# EAGLE design hbridge (EAGLE 5.06)
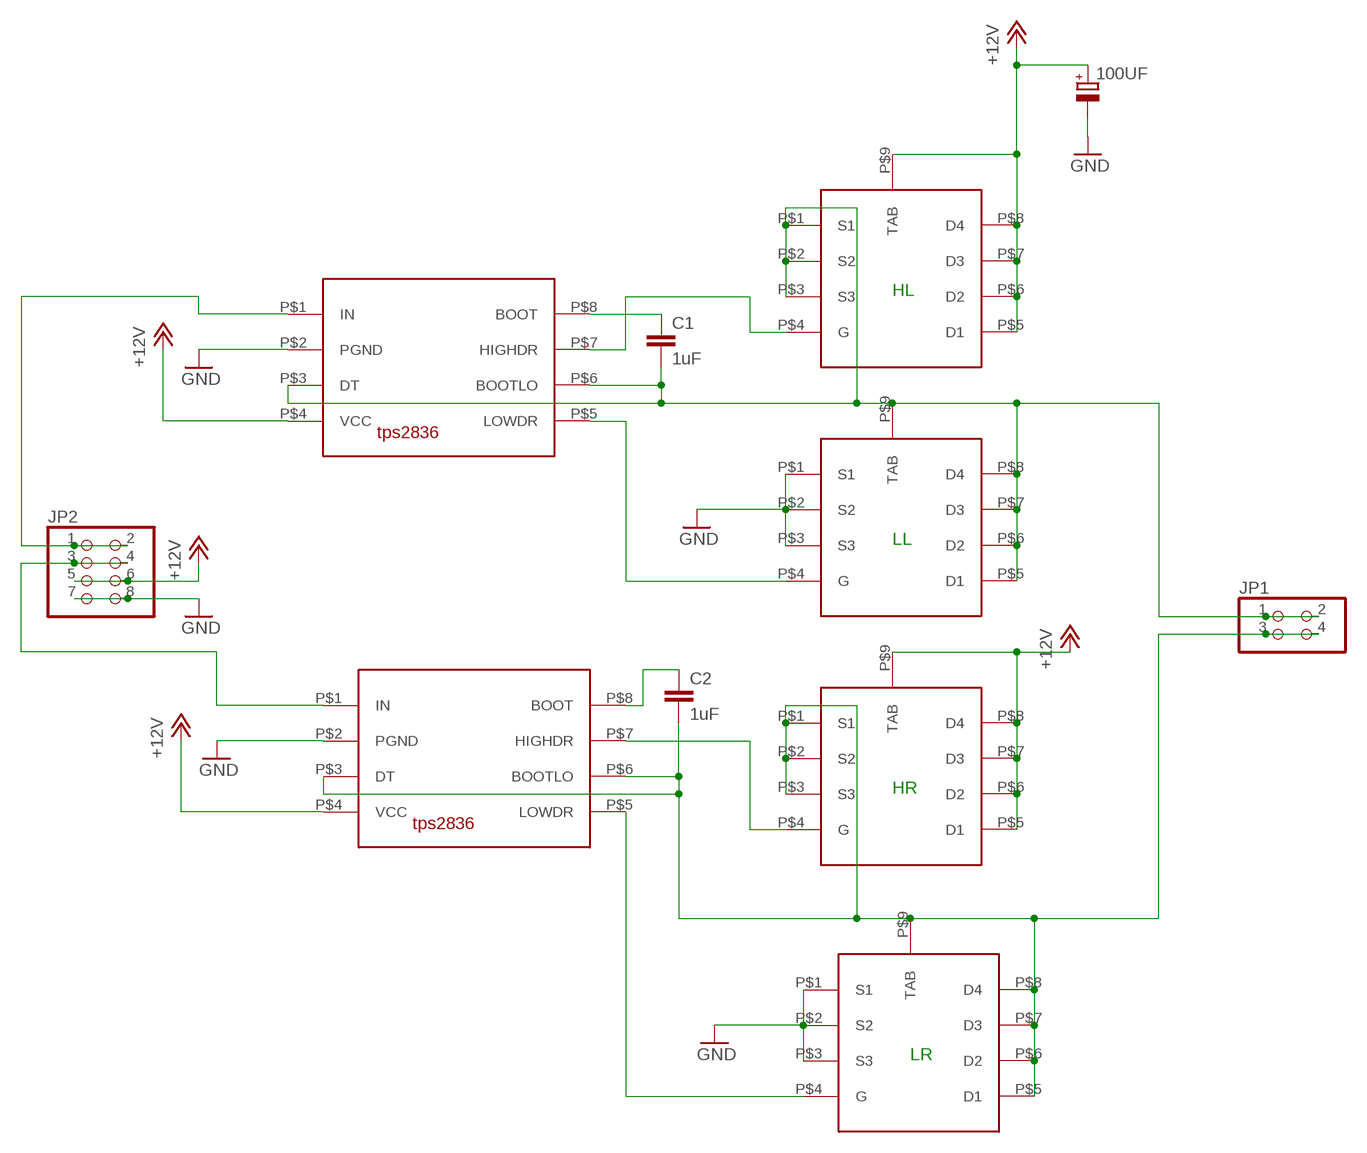
[diagram p0: schematic, sheet 1]

## Parts
100UF  CPOL-EU175TMP-0808  [175TMP-0808]
C1  1uF  C-EUC0805K  [C0805K]
C2  1uF  C-EUC0805K  [C0805K]
JP1  PINHD-2X2  [2X02]
JP2  PINHD-2X4  [2X04]
U$1  TPS2836  [D-SOIC-8]
U$2  TPS2836  [D-SOIC-8]
U$3  CSD16404  [QFN-8]
U$4  CSD16404  [QFN-8]
U$5  CSD16404  [QFN-8]
U$6  CSD16404  [QFN-8]

## Nets
+12V: 100UF.+ JP2.5 JP2.6 U$1.P$4(VCC) U$2.P$4(VCC) U$3.P$5(D1) U$3.P$6(D2) U$3.P$7(D3) U$3.P$8(D4) U$3.P$9(TAB) U$5.P$5(D1) U$5.P$6(D2) U$5.P$7(D3) U$5.P$8(D4) U$5.P$9(TAB)
GND: 100UF.- JP2.7 JP2.8 U$1.P$2(PGND) U$2.P$2(PGND) U$4.P$1(S1) U$4.P$2(S2) U$4.P$3(S3) U$6.P$1(S1) U$6.P$2(S2) U$6.P$3(S3)
N$1: C1.2 JP1.1 JP1.2 U$1.P$3(DT) U$1.P$6(BOOTLO) U$3.P$1(S1) U$3.P$2(S2) U$3.P$3(S3) U$4.P$5(D1) U$4.P$6(D2) U$4.P$7(D3) U$4.P$8(D4) U$4.P$9(TAB)
N$2: C1.1 U$1.P$8(BOOT)
N$4: U$1.P$7(HIGHDR) U$3.P$4(G)
N$5: U$1.P$5(LOWDR) U$4.P$4(G)
N$7: U$2.P$7(HIGHDR) U$5.P$4(G)
N$12: U$2.P$5(LOWDR) U$6.P$4(G)
N$14: C2.1 U$2.P$8(BOOT)
N$15: C2.2 JP1.3 JP1.4 U$2.P$3(DT) U$2.P$6(BOOTLO) U$5.P$1(S1) U$5.P$2(S2) U$5.P$3(S3) U$6.P$5(D1) U$6.P$6(D2) U$6.P$7(D3) U$6.P$8(D4) U$6.P$9(TAB)
N$17: JP2.1 JP2.2 U$1.P$1(IN)
N$18: JP2.3 JP2.4 U$2.P$1(IN)

## Notes on the sheet
- HL
- LL
- HR
- LR

## Library data of the parts
100UF = rcl:CPOL-EU: POLARIZED CAPACITOR, European symbol
C1 C2 = rcl:C-EU: CAPACITOR, European symbol
JP1 = pinhead:PINHD-2X2: PIN HEADER
JP2 = pinhead:PINHD-2X4: PIN HEADER
U$1 U$2 = slom:TPS2836
U$3-U$6 = slom:CSD16404

## Board
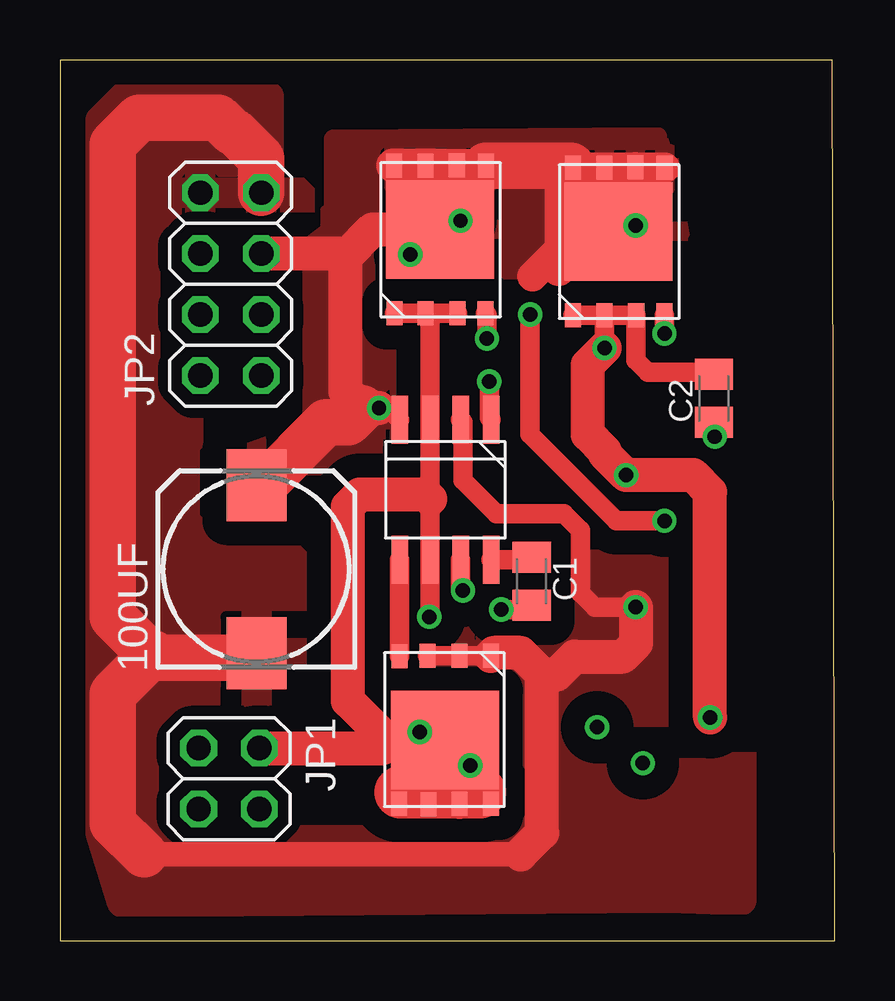
[diagram p1: board, top side]
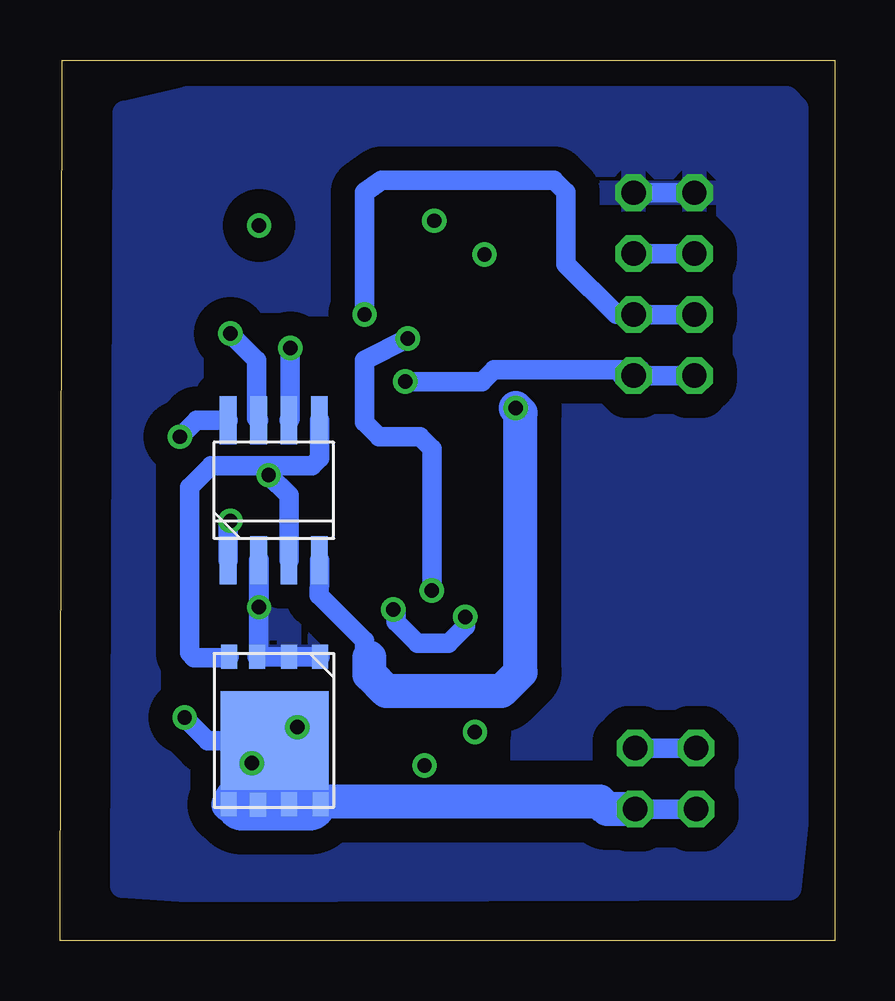
[diagram p2: board, bottom side, seen from below]

Size 32.3 x 36.7 mm. Coordinates in mm from the lower left corner, seen from the top.
Outline: 0,0 32.3,0 32.2,36.7 0,36.7 0,0
Copper layers (1*16): Top 0.035mm / dielectric 1.5mm / Bottom 0.035mm
Design rules "default": minimum track width 10mil, minimum drill 24mil, track to track 8mil, track to pad 8mil, pad to pad 8mil, via to via 8mil, smd to smd 8mil, copper to edge 40mil, drill to drill 8mil, minimum pad ring 10mil, minimum via ring 8mil, stop-mask expansion 4mil, vias tented up to drill 0mil, thermal gap 10mil

### Footprints (pad centres in the part's own frame; a part is rotated, then mirrored left to right if it is on the bottom)
175TMP-0808 = smd 3 x 2.5: + 3.5,0; - -3.5,0
C0805K = smd 1.3 x 1.6: 1 -1,0; 2 1,0
2X02 = drill 1.016 octagon: 1 -1.27,-1.27; 2 -1.27,1.27; 3 1.27,-1.27; 4 1.27,1.27
2X04 = drill 1.016 octagon: 1 -3.81,-1.27; 2 -3.81,1.27; 3 -1.27,-1.27; 4 -1.27,1.27; 5 1.27,-1.27; 6 1.27,1.27; 7 3.81,-1.27; 8 3.81,1.27
D-SOIC-8 = smd 0.7 x 2: P$1 -1.905,-2.921; P$2 -0.635,-2.921; P$3 0.635,-2.921; P$4 1.905,-2.921; P$5 1.905,2.921; P$6 0.635,2.921; P$7 -0.635,2.921; P$8 -1.905,2.921
QFN-8 = smd 1 x 0.67: P$1 0.53,4.23; P$2 0.53,2.93; P$3 0.53,1.6; P$4 0.54,0.43; P$5 6.69,0.41; P$6 6.7,1.63; P$7 6.69,2.93; P$8 6.69,4.24 | smd 4.1 x 4.5: P$9 4.03,2.33

### Placement (x,y rotation side)
100UF  8.19,15.49 90 top
C1  19.66,14.98 270 top
C2  27.26,22.6 90 top
JP1  7.05,6.76 270 top
JP2  7.12,27.36 90 top
U$1  16.07,18.79 180 top
U$2  23.39,18.77 0 bottom
U$3  18.17,25.61 90 top
U$4  13.73,12.4 270 top
U$5  25.62,25.53 90 top
U$6  25.68,12.37 270 bottom

### Tracks (layer width: path | path; a pad name or v marks a point on that pad's centre or on a via)
+12V  (via drill 0.6 pad 1.02)
  Top 0.813: U$3.P$7 U$3.P$8 | v13.3,22.2 13.68,22.2 U$1.P$4 | U$5.P$9 23.29,31.62 U$5.P$7 | 24.22,32.22 U$5.P$6
  Top 1.27: U$3.P$7 15.24,30.66 15.7,30.2 | 15.7,30.2 15.7,32 16,32.3 U$3.P$6 U$3.P$5 | U$3.P$9 15.84,30.06 15.7,30.2 | 20.9,32.4 21.2,32.4 U$5.P$8 U$5.P$7 U$5.P$6 | U$5.P$5 24.22,32.22 19.7,27.7
  Top 1.422: 13.9,32.3 U$3.P$7 16,32.3 U$3.P$5 | 20.9,32.4 20.9,28.1 20.8,28 | 13.04,29.64 U$3.P$9 | 13.04,29.64 11.9,28.5 11.9,22.9 12.6,22.2 v13.3,22.2 | JP2.5 12.03,28.63 13.04,29.64
  Top 1.93: 100UF.+ 8.49,18.99 11.1,21.6 12,21.6 12.6,22.2 | U$3.P$5 21.3,32.3 U$5.P$8
  Bottom 0.813: U$2.P$4 21.48,15.09 21.5,14.4 19.6,12.5 19.6,12 19.4,11.8 | JP2.5 JP2.6
  Bottom 1.422: 19.4,11.8 19.4,11.1 18.7,10.4 13.9,10.4 13.1,11.2 13.1,22 v13.3,22.2
  pour Top (isolate 1): 13.3,32.8 25,32.9 25.4,32.8 25.4,27.8 14,27.6 13.3,28.4 13.4,29.1
  pour Top (isolate 1): 10.5,21.3 10.5,29 11.3,29.6 11.2,30.3 11.4,30.3 11.4,33.4 24.9,33.5 25.3,32.4 26.3,26.9 25.9,26.4 15.1,26.1 15,21.3 13.1,21.3 13,19.5 7.2,20.1
GND  (via drill 0.6 pad 1.02)
  Top 0.813: U$4.P$3 U$4.P$2 U$4.P$1 | v24,13.9 22.3,13.9 21.7,14.5 21.7,17.1 21,17.8 18.2,17.8 16.8,19.2 16.8,21.62 U$1.P$2
  Top 1.016: 3.5,3.6 19.2,3.6
  Top 1.422: 3.89,11.99 100UF.- | 19.2,3.6 20.1,4.5 20.1,11.1 | 20.1,11.1 19.2,12 18.09,12 U$4.P$1 | 20.1,11.1 20.71,11.1 U$6.P$1 23.46,11.84 24.02,12.4 24.02,13.88 v24,13.9
  Top 1.93: JP2.7 8.39,32.61 7.3,33.7 7.2,33.7 6.6,34.3 3.3,34.3 2.2,33.2 2.2,13.5 3.9,11.8 8,11.8 100UF.- | 3.89,11.99 2.2,10.3 2.2,4.9 3.5,3.6
  Bottom 0.813: U$6.P$1 U$6.P$2 U$6.P$3 24.02,11.89 U$2.P$2 24,15.87 v24,13.9 | JP2.7 JP2.8
  pour Top (isolate 1): 8.7,31.3 8.7,35.2 8.5,35.4 2.9,35.4 1.7,34.2 1.7,4.5 2.6,1.6 25.3,1.8 28.4,1.7 28.4,15.6 22.8,15.6 21.3,17.1 14.7,17.1 13.4,15.8 13.4,11.2 14.8,9.8 17.2,9.8 17.9,9.1 17.9,4.3 17.8,4.2 9.3,4.2 9.1,4 4.6,4 3.6,5 3.6,9.1 4.6,10.1 9.7,10.1 10,10.4 10,15.6 9.5,16.1 6.6,16.1 5.2,17.5 5.2,20.7 6.1,21.6 9.5,21.6 10.3,22.4 10.3,30.8 9.8,31.3
  pour Bottom (isolate 1): 2,35.1 27,35.1 29.6,34.5 29.7,2.3 27,2.1 1.9,2.2 1.6,4.9 1.6,34.7
N$1  (via drill 0.6 pad 1.02)
  Top 0.813: U$4.P$8 U$4.P$7 U$4.P$6 U$4.P$5 14.14,6.14 14.2,6.2 | U$3.P$2 U$3.P$1 | U$3.P$2 U$3.P$3 | U$3.P$2 15.44,25.95 U$1.P$3 15.44,18.4 U$1.P$6 15.44,13.54 v15.4,13.5 | v18.4,13.8 19.48,13.8 C1.2
  Top 1.27: U$4.P$7 16.66,7.77 U$4.P$9
  Top 1.422: 13.8,8.37 U$4.P$9 | 13.8,8.37 13.63,8.37 12,10 12,18.1 12.5,18.6 15.24,18.6 15.44,18.4 | JP1.2 13.46,8.03 13.8,8.37
  Top 2.184: 14.2,6.2 17.5,6.2
  Bottom 0.813: v15.4,13.5 15.4,13.1 16.1,12.4 17.4,12.4 18.3,13.3 18.3,13.7 v18.4,13.8 | JP1.1 JP1.2
N$2
  Top 0.813: U$1.P$8 19.55,15.87 C1.1
N$3
  Bottom 2.184: 21.9,5.7 24.7,5.7 24.8,5.8
N$4  (via drill 0.6 pad 1.02)
  Top 0.813: U$1.P$7 16.7,14.7 v16.8,14.6 | v17.8,25.1 17.8,26.09 U$3.P$4
  Bottom 0.813: v16.8,14.6 16.8,20.5 17.3,21 19,21 19.6,21.6 19.6,24.2 v17.8,25.1
N$5
  Top 0.813: U$1.P$5 U$4.P$4
N$6  (via drill 0.6 pad 1.02)
  other vias: 14.6,28.6
N$7  (via drill 0.6 pad 1.02)
  Top 0.813: U$5.P$4 v25.19,25.31 v25.2,25.3
  Bottom 0.813: v25.2,25.3 24.1,24.2 24.1,21.77 U$2.P$7
N$9  (via drill 0.6 pad 1.02)
  other vias: 17.1,7.3
N$10  (via drill 0.6 pad 1.02)
  other vias: 24.3,7.4
N$11  (via drill 0.6 pad 1.02)
  other vias: 15,8.7
N$12
  Bottom 0.813: U$2.P$5 21.48,20.12 21.8,19.8 26,19.8 26.9,18.9 26.9,12 26.7,11.8 25.28,11.8 U$6.P$4
N$13  (via drill 0.6 pad 1.02)
  other vias: 22.4,8.9
N$14  (via drill 0.6 pad 1.02)
  Top 0.813: v27.3,21 27.3,21.56 C2.1
  Bottom 0.813: U$2.P$8 26.61,21.69 v27.3,21
N$15  (via drill 0.6 pad 1.02)
  Top 0.813: U$5.P$2 U$5.P$1 | U$5.P$2 U$5.P$3 24.02,24.18 24.5,23.7 27.16,23.7 C2.2 | U$5.P$2 22.69,25.41 v22.7,24.7
  Top 1.422: v27.1,9.3 27.1,18.7 26.4,19.4 v23.6,19.4 22.7,20.3 22.7,20.4 22,21.1 22,24 v22.7,24.7
  Bottom 0.813: U$6.P$7 U$6.P$8 | U$6.P$7 U$6.P$6 U$6.P$5 | v22.7,24.7 22.7,21.75 U$2.P$6 | v27.1,9.3 26.14,8.34 U$6.P$9 23.35,6.28 U$6.P$7 | U$2.P$3 22.75,18.55 v23.6,19.4 | JP1.3 JP1.4
  Bottom 1.422: U$6.P$7 22.56,5.49 | JP1.4 9.49,5.49 9.8,5.8 25.15,5.8 U$6.P$5
N$16  (via drill 0.6 pad 1.02)
  other vias: 24,29.8
N$17  (via drill 0.6 pad 1.02)
  Top 0.813: v17.9,23.3 17.9,21.79 U$1.P$1
  Bottom 0.813: JP2.2 JP2.1 | JP2.1 8.85,23.55 8.9,23.6 | 8.9,23.6 8.44,23.6 JP2.1 | 8.9,23.6 8.8,23.8 | 8.9,23.6 8.4,23.6 8.1,23.8 | v17.9,23.3 14.7,23.3 14.2,23.8 8.64,23.8 JP2.1
N$18  (via drill 0.6 pad 1.02)
  Top 0.813: v25.2,17.5 23.2,17.5 19.6,21.1 v19.6,26.1
  Bottom 0.813: JP2.4 JP2.3 9.1,26.1 11.2,28.2 11.2,31.2 11.7,31.7 18.9,31.7 19.6,31.2 v19.6,26.1 | U$2.P$1 25.29,17.41 v25.2,17.5
N$19  (via drill 0.6 pad 1.02)
  other vias: 16.7,30